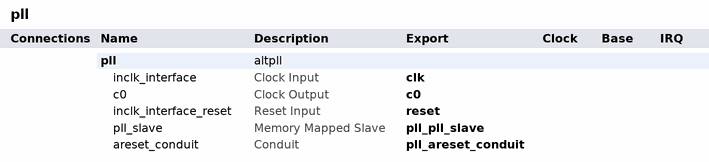
[diagram p0: system contents]
# Platform Designer (Qsys) system pll, Cyclone IV E EP4CE115F29C7
# Parameters at their usual value, and those the tool derives, are not listed.
package require qsys
create_system pll
set_project_property DEVICE_FAMILY {Cyclone IV E}
set_project_property DEVICE EP4CE115F29C7

add_instance pll altpll 18.1
set_instance_parameter_value pll CLK0_DIVIDE_BY 2000
set_instance_parameter_value pll CLK0_MULTIPLY_BY 1007
set_instance_parameter_value pll INCLK0_INPUT_FREQUENCY 20000
set_instance_parameter_value pll OPERATION_MODE SOURCE_SYNCHRONOUS
set_instance_parameter_value pll PORT_ARESET PORT_USED
set_instance_parameter_value pll PORT_LOCKED PORT_UNUSED
set_instance_parameter_value pll PORT_clk1 PORT_UNUSED
set_instance_parameter_value pll PORT_clk2 PORT_UNUSED
set_instance_parameter_value pll PORT_clk3 PORT_UNUSED

# exported interfaces
add_interface c0 clock source
set_interface_property c0 EXPORT_OF pll.c0
add_interface clk clock sink
set_interface_property clk EXPORT_OF pll.inclk_interface
add_interface pll_areset_conduit conduit end
set_interface_property pll_areset_conduit EXPORT_OF pll.areset_conduit
add_interface pll_pll_slave avalon slave
set_interface_property pll_pll_slave EXPORT_OF pll.pll_slave
add_interface reset reset sink
set_interface_property reset EXPORT_OF pll.inclk_interface_reset

set_interconnect_requirement {$system} qsys_mm.clockCrossingAdapter HANDSHAKE
set_interconnect_requirement {$system} qsys_mm.enableEccProtection FALSE
set_interconnect_requirement {$system} qsys_mm.insertDefaultSlave FALSE
set_interconnect_requirement {$system} qsys_mm.maxAdditionalLatency 1

save_system pll.qsys
